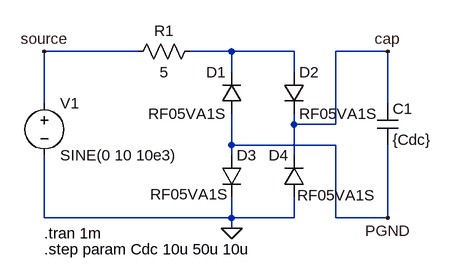
[diagram p0: schematic rectifier.asc]
rectifier.asc, the LTspice schematic file:
Version 4
SHEET 1 880 680
WIRE 16 32 -128 32
WIRE 160 32 96 32
WIRE 256 32 160 32
WIRE 400 32 320 32
WIRE 160 64 160 32
WIRE 256 64 256 32
WIRE -128 112 -128 32
WIRE 400 112 400 32
WIRE 256 144 256 128
WIRE 320 144 320 32
WIRE 320 144 256 144
WIRE 160 176 160 128
WIRE 320 176 160 176
WIRE 160 192 160 176
WIRE 256 192 256 144
WIRE -128 288 -128 192
WIRE 160 288 160 256
WIRE 160 288 -128 288
WIRE 256 288 256 256
WIRE 256 288 160 288
WIRE 320 288 320 176
WIRE 400 288 400 176
WIRE 400 288 320 288
WIRE 160 304 160 288
FLAG 160 304 0
FLAG -128 32 source
FLAG 400 32 cap
FLAG 400 288 PGND
SYMBOL voltage -128 96 R0
WINDOW 123 0 0 Left 0
WINDOW 39 0 0 Left 0
SYMATTR InstName V1
SYMATTR Value SINE(0 10 10e3)
SYMBOL res 112 16 R90
WINDOW 0 0 56 VBottom 2
WINDOW 3 32 56 VTop 2
SYMATTR InstName R1
SYMATTR Value 5
SYMBOL cap 384 112 R0
SYMATTR InstName C1
SYMATTR Value {Cdc}
SYMBOL diode 176 128 R180
WINDOW 0 24 64 Left 2
WINDOW 3 24 0 Left 2
SYMATTR InstName D1
SYMATTR Value RF05VA1S
SYMBOL diode 240 64 R0
SYMATTR InstName D2
SYMATTR Value RF05VA1S
SYMBOL diode 144 192 R0
WINDOW 3 -109 60 Left 2
SYMATTR InstName D3
SYMATTR Value RF05VA1S
SYMBOL diode 272 256 R180
WINDOW 0 24 64 Left 2
WINDOW 3 -109 3 Left 2
SYMATTR InstName D4
SYMATTR Value RF05VA1S
TEXT -128 312 Left 2 !.tran 1m
TEXT -128 336 Left 2 !.step param Cdc 10u 50u 10u

The netlist it stands for:
* rectifier.asc
V1 source 0 SINE(0 10 10e3)
R1 N001 source 5
C1 cap PGND {Cdc}
D1 PGND N001 RF05VA1S
D2 N001 cap RF05VA1S
D3 PGND 0 RF05VA1S
D4 0 cap RF05VA1S
.model D D
.lib standard.dio
.tran 1m
.step param Cdc 10u 50u 10u
.backanno
.end

* Results of the author's LTspice run, read from the files saved beside the schematic
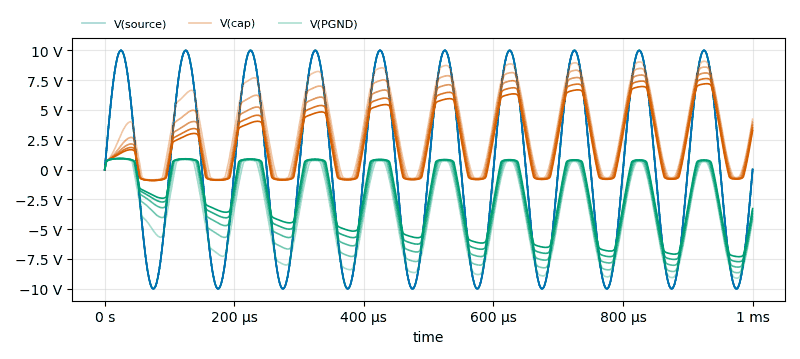
[diagram p1: Transient Analysis of rectifier.asc, plotted from the saved traces]
* Transient Analysis, 5 runs:
*   V(source) [cdc=1e-005]: min -10 V, max 10 V, average 4.993 µV, rms 7.074 V, last 0 V
*   V(source) [cdc=2e-005]: min -10 V, max 9.999 V, average 12.77 µV, rms 7.074 V, last 0 V
*   V(source) [cdc=3e-005]: min -10 V, max 10 V, average -132.9 µV, rms 7.072 V, last 0 V
*   V(source) [cdc=4e-005]: min -10 V, max 10 V, average -159.5 µV, rms 7.072 V, last 0 V
*   V(source) [cdc=5e-005]: min -10 V, max 10 V, average -202.8 µV, rms 7.071 V, last 0 V
*   V(cap) [cdc=1e-005]: min -861.8 mV, max 9.085 V, average 3.568 V, rms 4.907 V, last 4.225 V
*   V(cap) [cdc=2e-005]: min -893.5 mV, max 8.603 V, average 3.06 V, rms 4.422 V, last 3.974 V
*   V(cap) [cdc=3e-005]: min -906.8 mV, max 8.106 V, average 2.686 V, rms 4.039 V, last 3.724 V
*   V(cap) [cdc=4e-005]: min -914.1 mV, max 7.636 V, average 2.396 V, rms 3.728 V, last 3.489 V
*   V(cap) [cdc=5e-005]: min -918.8 mV, max 7.205 V, average 2.163 V, rms 3.469 V, last 3.273 V
*   V(PGND) [cdc=1e-005]: min -9.108 V, max 908.6 mV, average -3.677 V, rms 5.043 V, last -4.225 V
*   V(PGND) [cdc=2e-005]: min -8.654 V, max 922.6 mV, average -3.173 V, rms 4.561 V, last -3.974 V
*   V(PGND) [cdc=3e-005]: min -8.18 V, max 927.8 mV, average -2.797 V, rms 4.179 V, last -3.724 V
*   V(PGND) [cdc=4e-005]: min -7.728 V, max 930.5 mV, average -2.504 V, rms 3.866 V, last -3.489 V
*   V(PGND) [cdc=5e-005]: min -7.31 V, max 932.1 mV, average -2.268 V, rms 3.604 V, last -3.273 V